# Altium schematic sheet LNA_DIV.SchDoc
size A4 portrait; CompanyName: FairWaves LLC; DrawnBy: Andrey Sviyazov; DocumentNumber: 3; Revision: 1; SheetNumber: 3; SheetTotal: 5
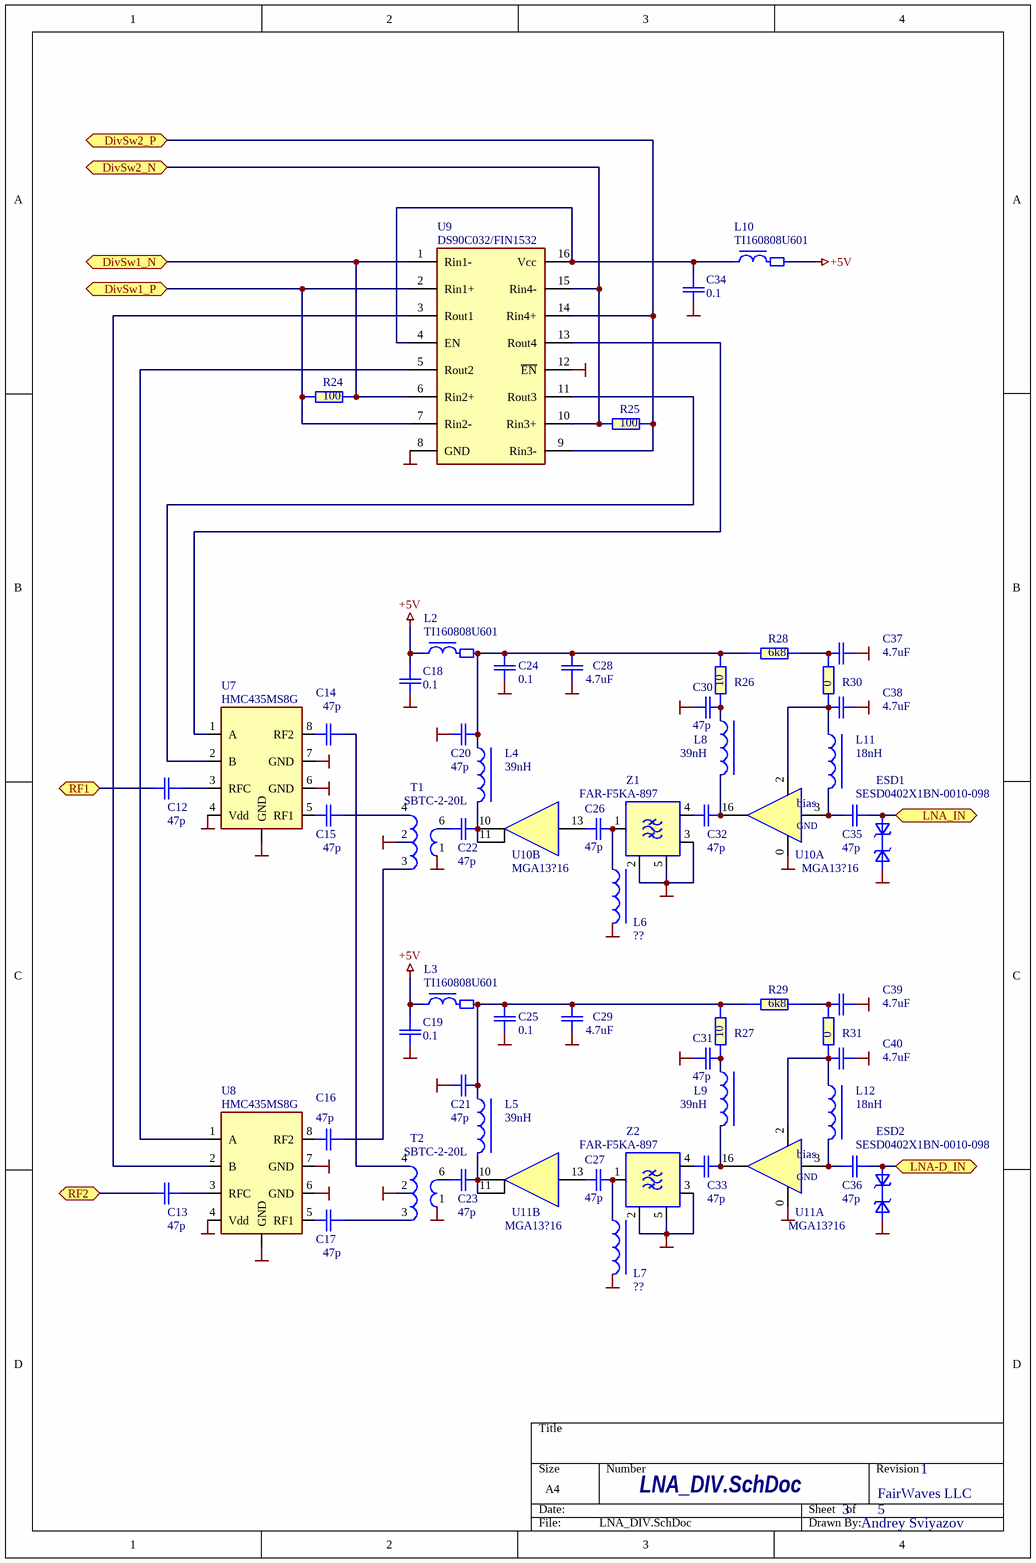
[diagram p0: LNA_DIV.SchDoc]

## Parts
C12  47p  [C0603-PHILLIPS]
C13  47p  [C0603-PHILLIPS]
C14  47p  [C0603-PHILLIPS]
C15  47p  [C0603-PHILLIPS]
C16  47p  [C0603-PHILLIPS]
C17  47p  [C0603-PHILLIPS]
C18  0.1  [C0603-Phillips]
C19  0.1  [C0603-Phillips]
C20  47p  [C0603-PHILLIPS]
C21  47p  [C0603-PHILLIPS]
C22  47p  [C0603-PHILLIPS]
C23  47p  [C0603-PHILLIPS]
C24  0.1  [C0603-Phillips]
C25  0.1  [C0603-Phillips]
C26  47p  [C0603-PHILLIPS]
C27  47p  [C0603-PHILLIPS]
C28  4.7uF  [C0603-Phillips]
C29  4.7uF  [C0603-Phillips]
C30  47p  [C0603-PHILLIPS]
C31  47p  [C0603-PHILLIPS]
C32  47p  [C0603-PHILLIPS]
C33  47p  [C0603-PHILLIPS]
C34  0.1  [C0603-Phillips]
C35  47p  [C0603-PHILLIPS]
C36  47p  [C0603-PHILLIPS]
C37  4.7uF  [C0603-Phillips]
C38  4.7uF  [C0603-Phillips]
C39  4.7uF  [C0603-Phillips]
C40  4.7uF  [C0603-Phillips]
ESD1  SESD0402X1BN-0010-098  [R0402-Phillips]
ESD2  SESD0402X1BN-0010-098  [R0402-Phillips]
L2  TI160808U601  [Ti160808-Phillips]
L3  TI160808U601  [Ti160808-Phillips]
L4  39nH  [TF160808-Phillips]
L5  39nH  [TF160808-Phillips]
L6  ??  [TF160808-Phillips]
L7  ??  [TF160808-Phillips]
L8  39nH  [TF160808-Phillips]
L9  39nH  [TF160808-Phillips]
L10  TI160808U601  [Ti160808-Phillips]
L11  18nH  [TF160808-Phillips]
L12  18nH  [TF160808-Phillips]
R24  100  [R0603-PHILLIPS]
R25  100  [R0603-PHILLIPS]
R26  10  [R0603-PHILLIPS]
R27  10  [R0603-PHILLIPS]
R28  6k8  [R0603-PHILLIPS]
R29  6k8  [R0603-PHILLIPS]
R30  0  [R0603-PHILLIPS]
R31  0  [R0603-PHILLIPS]
T1  SBTC-2-20L  [AT1030]
T2  SBTC-2-20L  [AT1030]
U7  HMC435MS8G  [MS8G]
U8  HMC435MS8G  [MS8G]
U9  DS90C032/FIN1532  [SOIC16]
U10  MGA13?16  [MGA13x16(GND NC Legs)]  (parts A,B of 2)
U11  MGA13?16  [MGA13x16(GND NC Legs)]  (parts A,B of 2)
Z1  FAR-F5KA-897  [SAW-1.4x1x0.5mm]
Z2  FAR-F5KA-897  [SAW-1.4x1x0.5mm]

## Ports
DivSw1_N, DivSw1_P, DivSw2_N, DivSw2_P, LNA-D_IN, LNA_IN, RF1, RF2

## Nets
+5V: C18.2 C19.2 L2.1 L3.1 L10.2
GND: C18.1 C19.1 C20.1 C21.1 C24.1 C25.1 C28.1 C29.1 C30.2 C31.2 C34.1 C37.2 C38.2 C39.2 C40.2 ESD1.1(A1) ESD2.1(A1) L6.2 L7.2 T1.1 T1.2 T2.1 T2.2 U7.0(GND) U7.4(Vdd) U7.6(GND) U7.7(GND) U8.0(GND) U8.4(Vdd) U8.6(GND) U8.7(GND) U9.8(GND) U9.12(~{EN}) U10.0(GND) U11.0(GND) Z1.2(GND) Z1.3(~{Out}) Z1.5(GND) Z2.2(GND) Z2.3(~{Out}) Z2.5(GND)
DivSw1_N: R24.2 U9.1(Rin1-) U9.6(Rin2+) ; port DivSw1_N
DivSw1_P: R24.1 U9.2(Rin1+) U9.7(Rin2-) ; port DivSw1_P
DivSw2_N: R25.1 U9.10(Rin3+) U9.15(Rin4-) ; port DivSw2_N
DivSw2_P: R25.2 U9.9(Rin3-) U9.14(Rin4+) ; port DivSw2_P
LNA-D_IN: C36.2 ESD2.2(A2) ; port LNA-D_IN
LNA_IN: C35.2 ESD1.2(A2) ; port LNA_IN
RF1: C12.1 ; port RF1
RF2: C13.1 ; port RF2
NetC12_2: C12.2 U7.3(RFC)
NetC13_2: C13.2 U8.3(RFC)
NetC14_1: C14.1 U7.8(RF2)
NetC14_2: C14.2 T2.4
NetC15_1: C15.1 U7.5(RF1)
NetC15_2: C15.2 T1.4
NetC16_1: C16.1 U8.8(RF2)
NetC16_2: C16.2 T1.3
NetC17_1: C17.1 U8.5(RF1)
NetC17_2: C17.2 T2.3
NetC20_2: C20.2 C24.2 C28.2 L2.2 L4.1 R26.2 R28.1
NetC21_2: C21.2 C25.2 C29.2 L3.2 L5.1 R27.2 R29.1
NetC22_1: C22.1 T1.6
NetC22_2: C22.2 L4.2 U10.10(Out2/VDD) U10.11(Out2/VDD)
NetC23_1: C23.1 T2.6
NetC23_2: C23.2 L5.2 U11.10(Out2/VDD) U11.11(Out2/VDD)
NetC26_1: C26.1 U10.13(In2)
NetC26_2: C26.2 L6.1 Z1.1(IN)
NetC27_1: C27.1 U11.13(In2)
NetC27_2: C27.2 L7.1 Z2.1(IN)
NetC30_1: C30.1 L8.1 R26.1
NetC31_1: C31.1 L9.1 R27.1
NetC32_1: C32.1 Z1.4(Out)
NetC32_2: C32.2 L8.2 U10.16(Out1/VDD)
NetC33_1: C33.1 Z2.4(Out)
NetC33_2: C33.2 L9.2 U11.16(Out1/VDD)
NetC34_2: C34.2 L10.1 U9.4(EN) U9.16(Vcc)
NetC35_1: C35.1 L11.2 U10.3(In1)
NetC36_1: C36.1 L12.2 U11.3(In1)
NetC37_1: C37.1 R28.2 R30.2
NetC38_1: C38.1 L11.1 R30.1 U10.2(BIAS)
NetC39_1: C39.1 R29.2 R31.2
NetC40_1: C40.1 L12.1 R31.1 U11.2(BIAS)
NetU7_1: U7.1(A) U9.13(Rout4)
NetU7_2: U7.2(B) U9.11(Rout3)
NetU8_1: U8.1(A) U9.5(Rout2)
NetU8_2: U8.2(B) U9.3(Rout1)

## Notes on the sheet
- (in symbol MGA13116, part A) bias

## Library data of the parts
C12-C17 C20-C23 C26 C27 C30-C33 C35 C36 = C0603: Capacitor; Manufacturer: MURATA; Tolerance: 20%; Name: SMD0603; U/P/TKE: NP0; Value: 47p
C18 C19 C24 C25 C28 C29 C34 C37-C40 = C0603: Capacitor; Manufacturer: MURATA; Tolerance: 20%; Name: SMD0603; U/P/TKE: Y5V
  C18 C19 C24 C25 C34: Value: 0.1
  C28 C29 C37-C40: Value: 4.7uF
ESD1 ESD2 = SESD0402X: ESD diod bi-directional; Manufacturer: Tyco Electronics Corp; U/P/TKE: 9.8V; Name: SESD0402X1BN-0010-098
L2 L3 L10 = TI160808: Choke; Manufacturer: MURATA; Name: TI160808U601; Value: *
L4-L9 L11 L12 = TF160808: Coil; Manufacturer: SMD; Name: TF160808
  L4 L5 L8 L9: Value: 39nH
  L6 L7: Value: ??
  L11 L12: Value: 18nH
R24-R31 = R0603: Resistor; Manufacturer: YAGEO; Tolerance: 5%; Name: SMD0603; U/P/TKE: 0.1W
  R24 R25: Value: 100
  R26 R27: Value: 10
  R28 R29: Value: 6k8
  R30 R31: Value: 0
T1 T2 = SBTC-2-10L: Transformer; Manufacturer: Mini-Cirquits; Name: SBTC-2-20L
U7 U8 = HMC435MS8G: IC; Manufacturer: Hittite; Swap: No; Misc: RF SPDT Switch High Isolation Non Reflective; Name: HMC435MS8G
U9 = DS90C032: IC; Manufacturer: National/Fairchild; Swap: No; Misc: Quad LVDS Receiver; Name: DS90C032/FIN1532
U10 U11 = MGA13116: IC; Manufacturer: AVAGO; Misc: Low Noise Amplifier 2 stages; Swap: No; Name: MGA13?16
Z1 Z2 = SAW 1.4x1.0-5 SMD: SAW Filter; Manufacturer: Taiyo Yuden; Misc: Low-Loss Filter for Mobile Communication; Name: FAR-F5KA-897